# Altium schematic sheet 03.SchDoc
size 420 x 297 mm
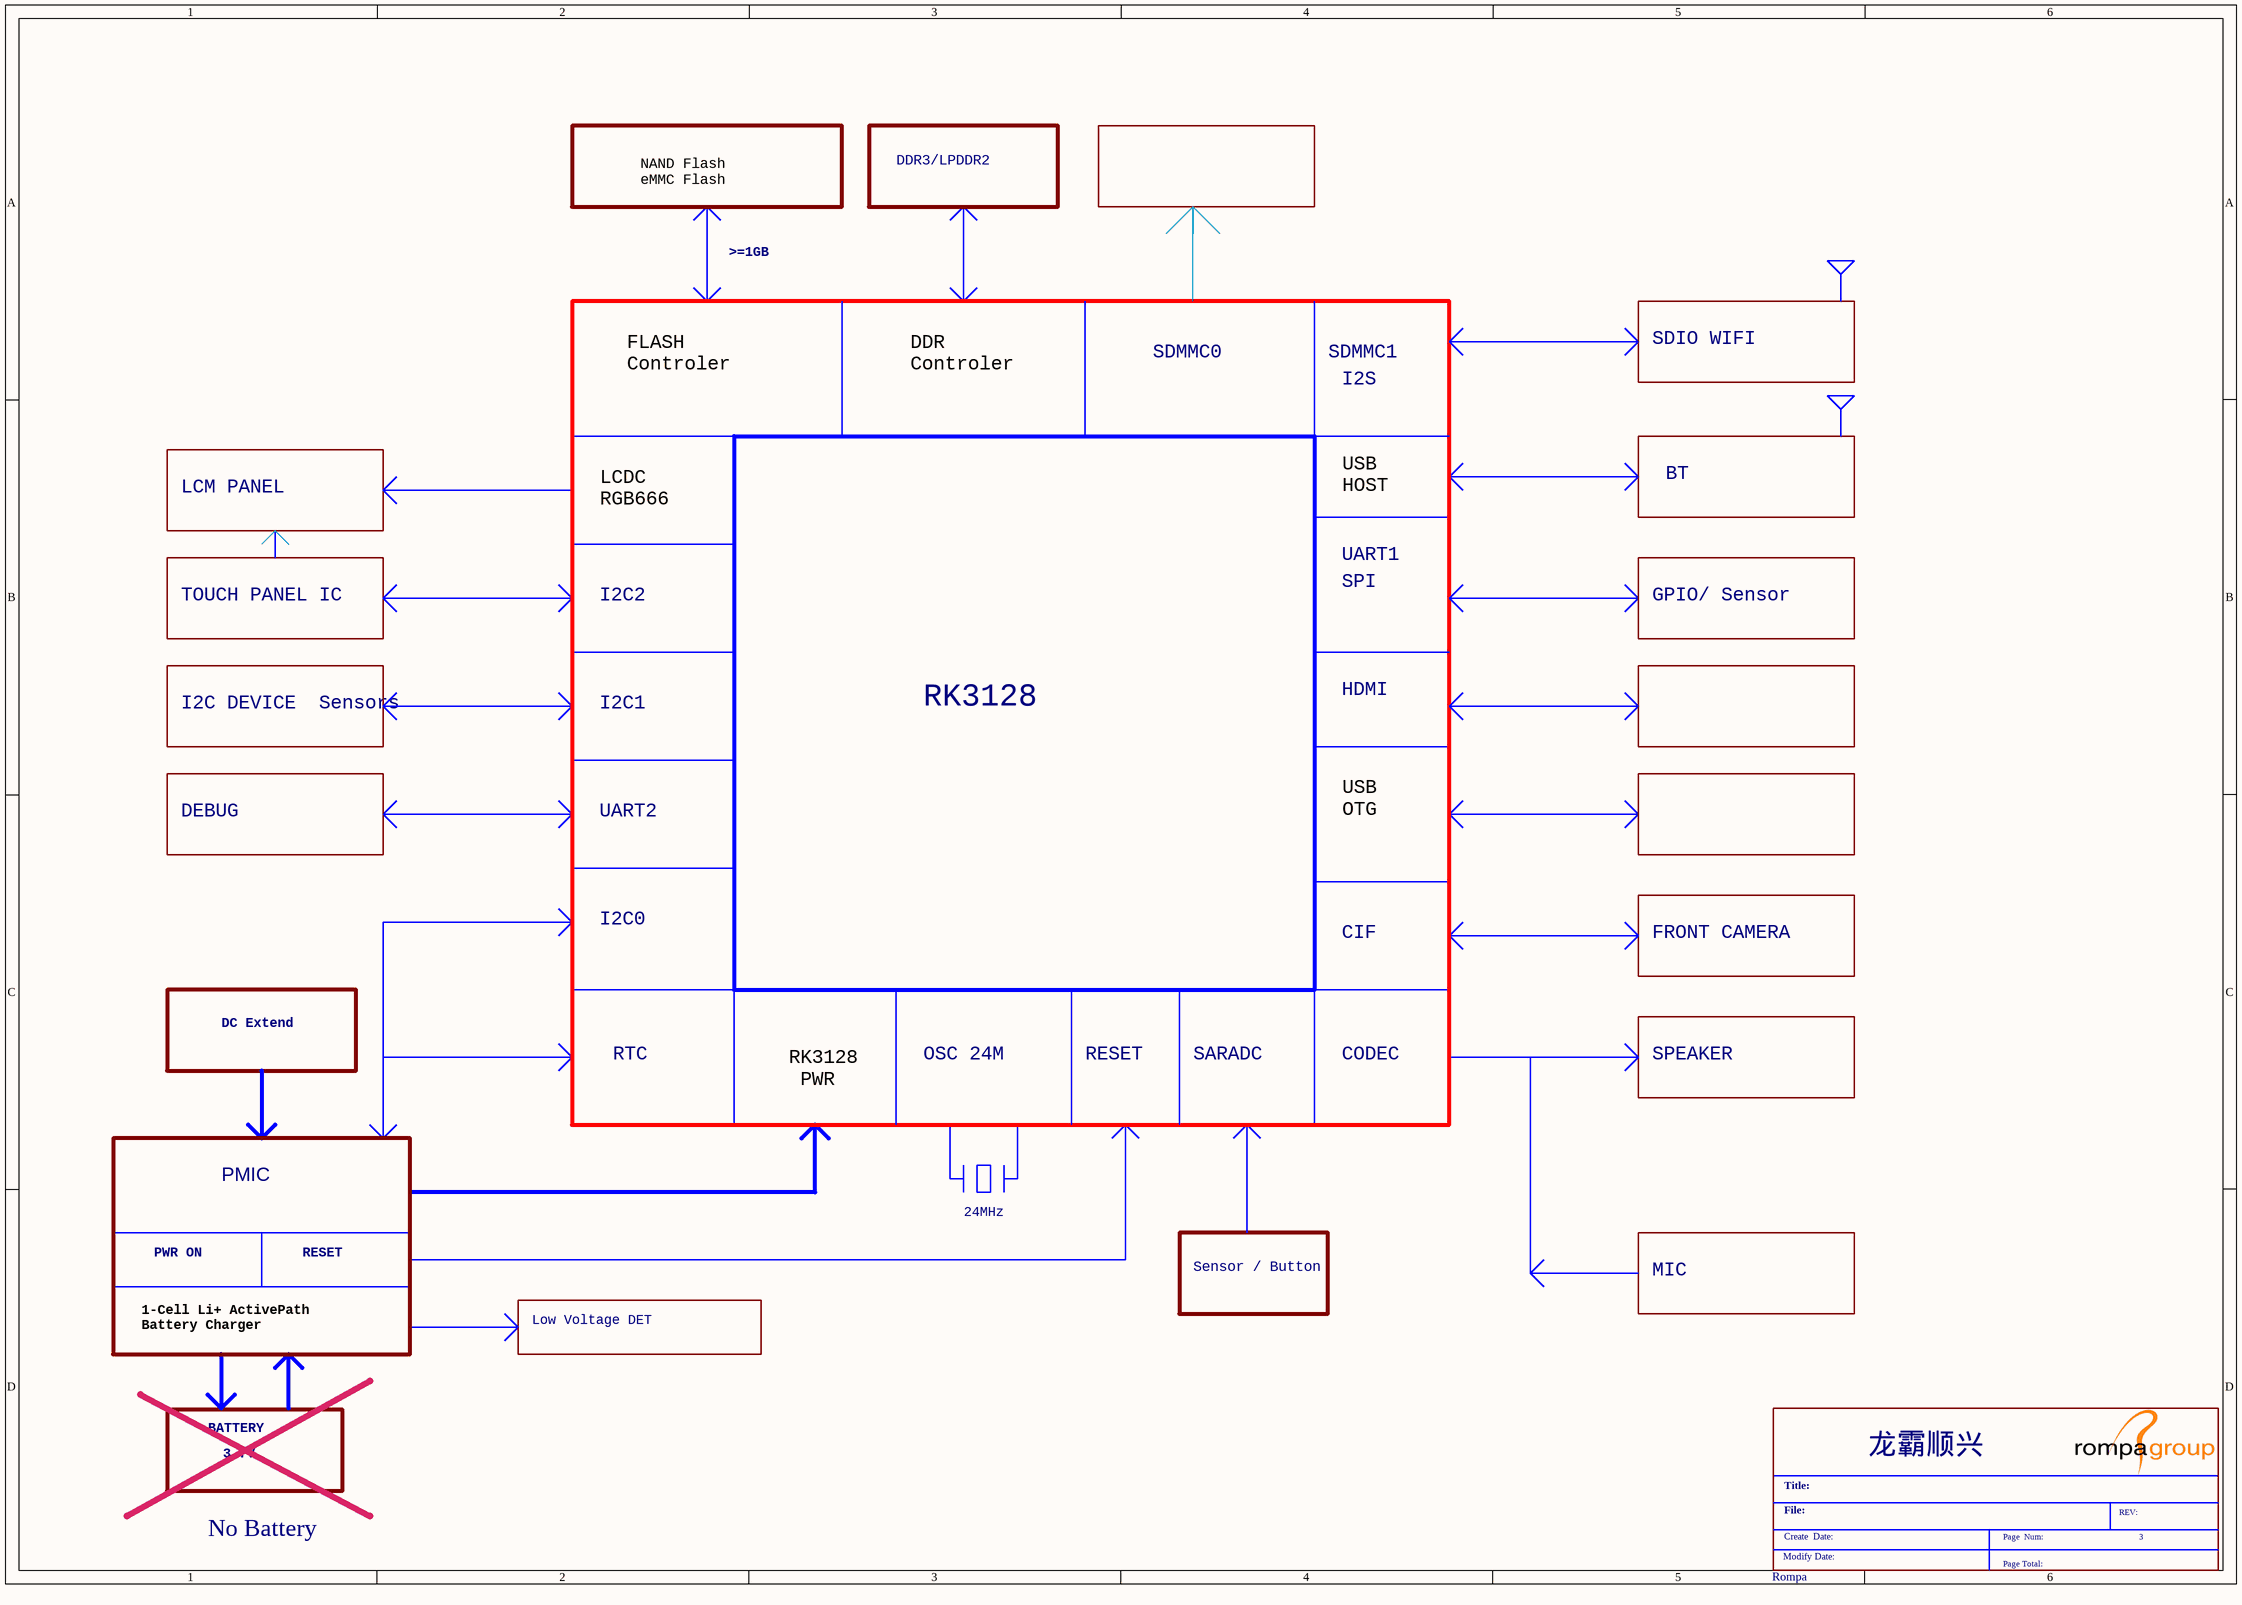
[diagram p0: 03.SchDoc]

## Parts
*  Rompa  Schematic Page Number: 3  (graphical)

## Notes on the sheet
- NAND Flash
  eMMC Flash
- DDR3/LPDDR2
- >=1GB
- FLASH
  Controler
- DDR
  Controler
- SDMMC0
- SDMMC1
- I2S
- SDIO WIFI
- LCM PANEL
- LCDC
  RGB666
- USB
  HOST
- BT
- SPI
- UART1
- TOUCH PANEL IC
- I2C2
- GPIO/ Sensor
- I2C DEVICE  Sensors
- I2C1
- RK3128
- HDMI
- DEBUG
- UART2
- USB
  OTG
- I2C0
- CIF
- FRONT CAMERA
- DC Extend
- RTC
- OSC 24M
- RESET
- SARADC
- CODEC
- SPEAKER
- RK3128
  PWR
- PMIC
- PWR ON
- 24MHz
- Sensor / Button
- 1-Cell Li+ ActivePath
  Battery Charger
- Low Voltage DET
- MIC
- BATTERY
- 3.7V
- No Battery
- (in symbol Rompa) 龙霸顺兴; Title:; File:; REV:; Create  Date:; Page  Num:; Modify Date:; Page Total: